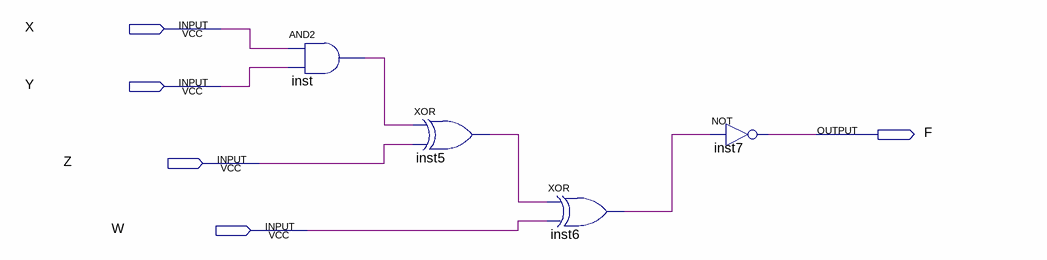
[diagram p0: schematic sheet]
// Quartus schematic lab.bdf as structural Verilog: 4 symbols, 5 pins
module lab (
  input  X,
  input  Y,
  input  Z,
  input  W,
  output F
);

  wire inst5_out, inst6_out, inst_out;

  and inst (inst_out, X, Y);
  xor inst5 (inst5_out, inst_out, Z);
  xor inst6 (inst6_out, inst5_out, W);
  not inst7 (F, inst6_out);
endmodule
